# Altium schematic sheet CONNECTOR_B.SchDoc: =project_title
size Tabloid; CompanyName: Luxonis Holding; Organization: Luxonis Holding; Address1: 1925 Harmony Park Drive; Address2: Westminster, CO; Address3: 80234; Address4: United States; SheetNumber: 6; SheetTotal: 13
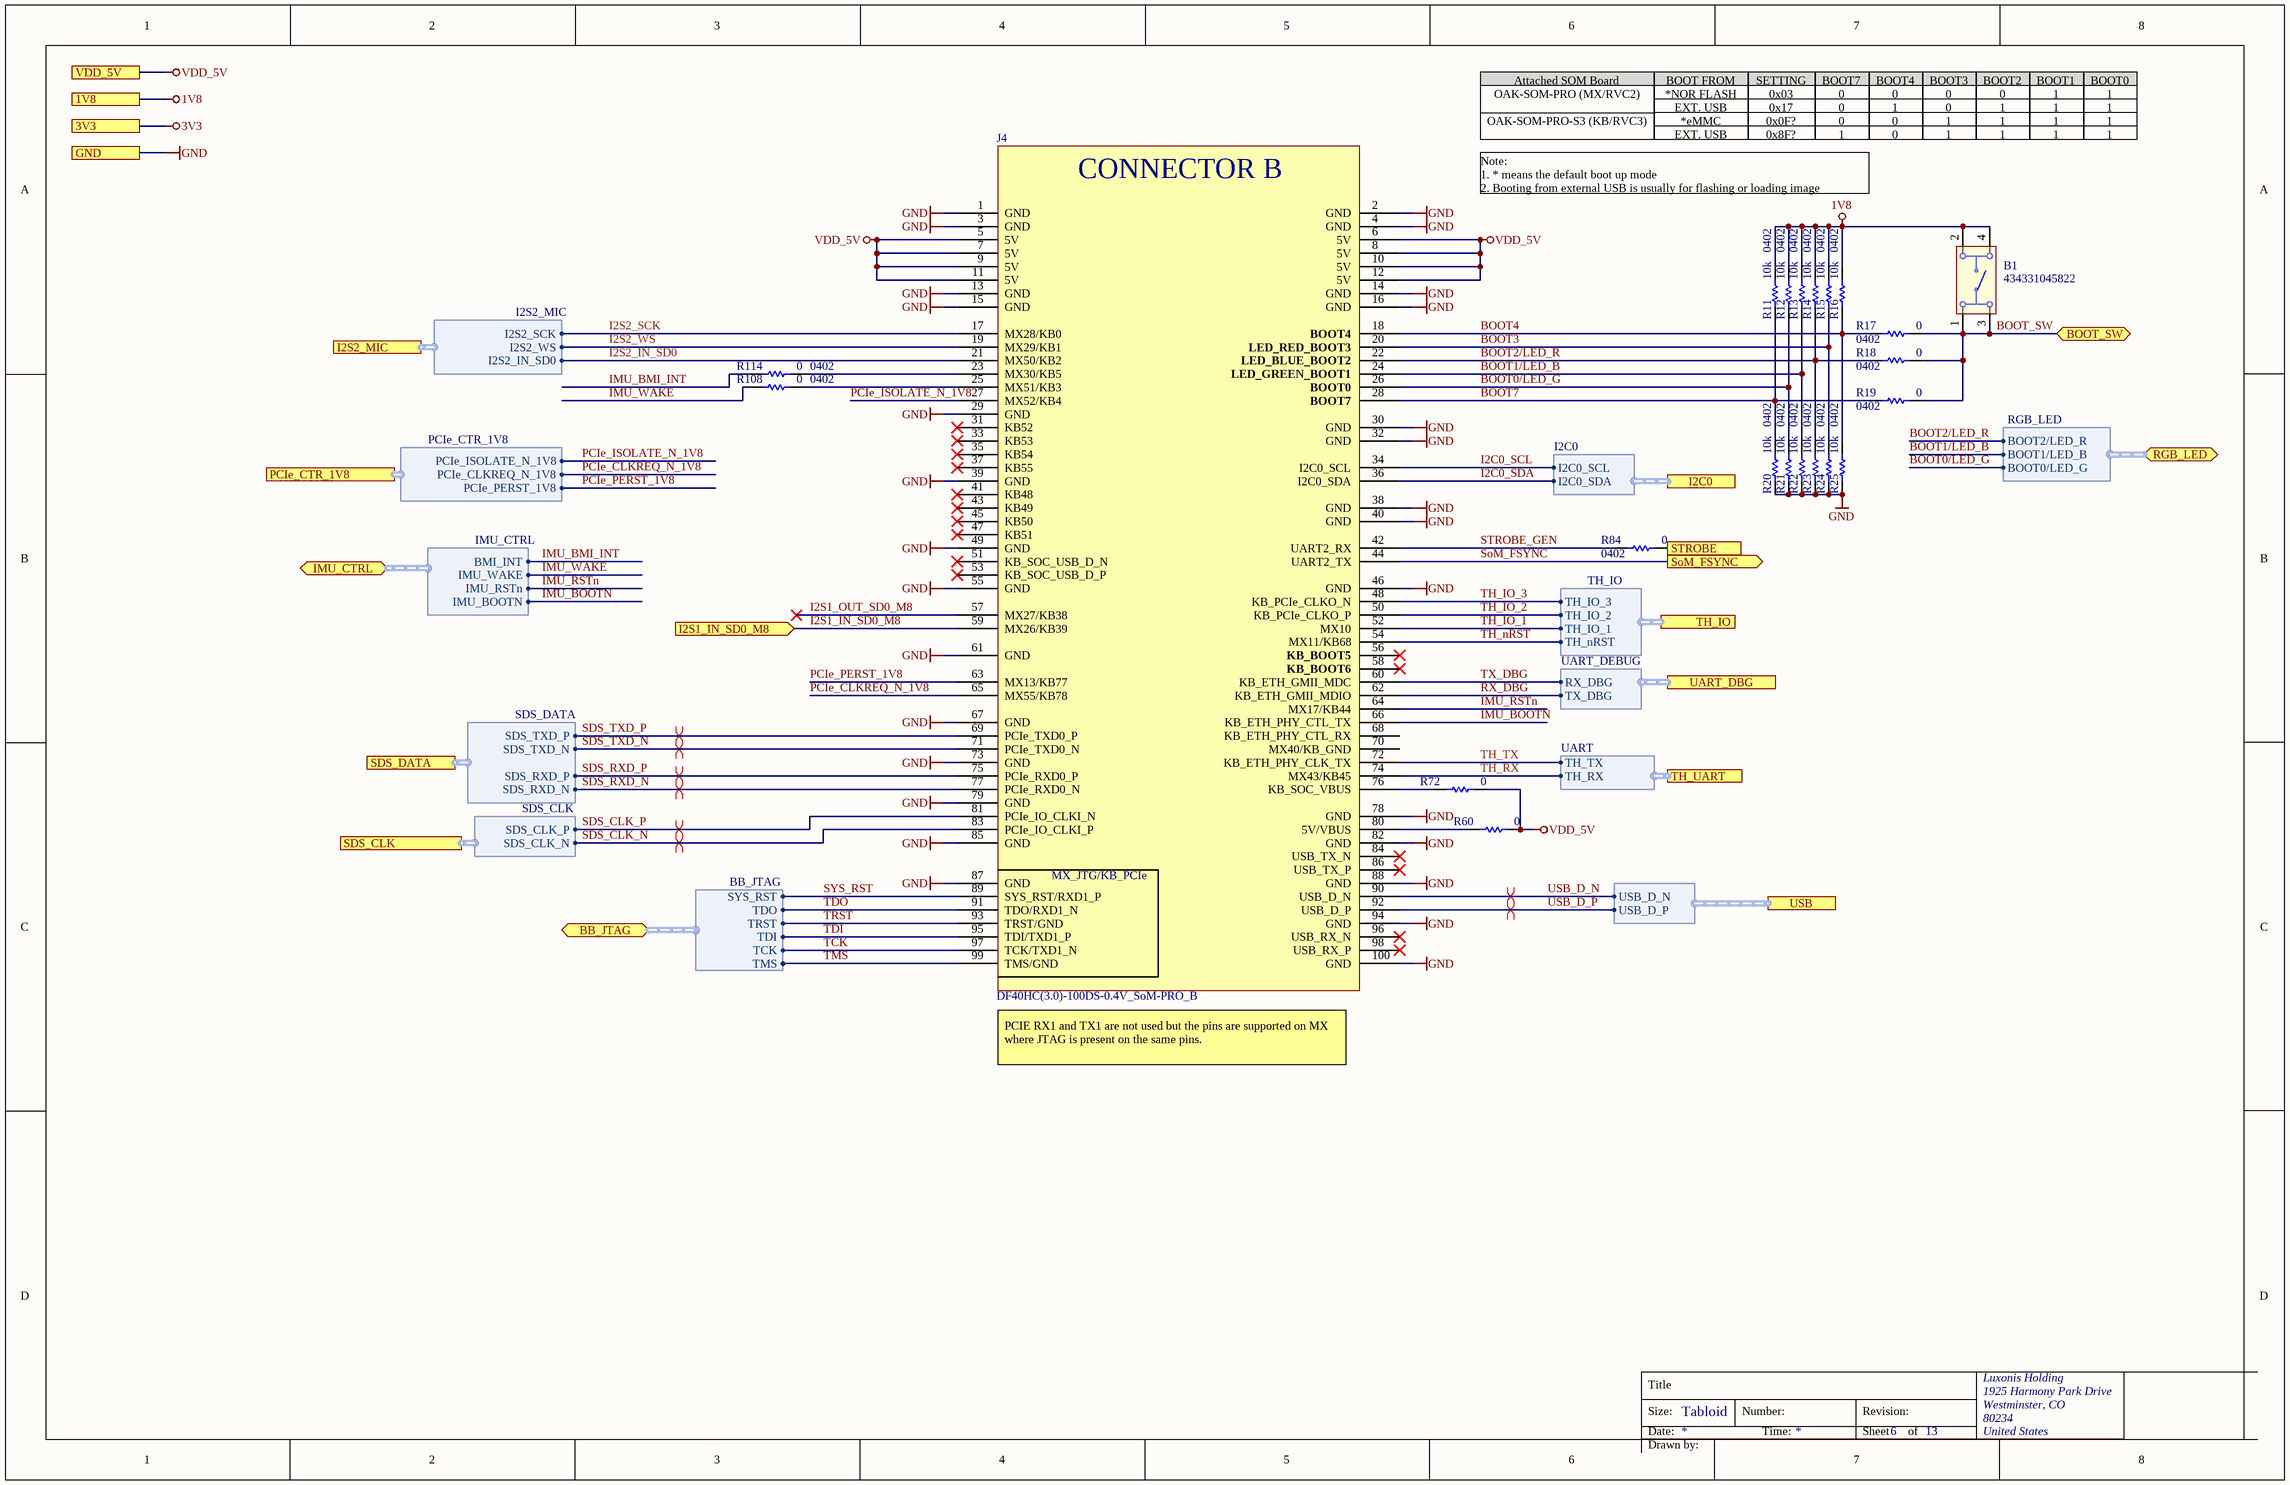
[diagram p0: CONNECTOR_B.SchDoc]

## Parts
B1  434331045822  [434331045822]
J4  DF40HC(3.0)-100DS-0.4V_SoM-PRO_B  [CON_B_BW2099_SoM_DF40HC-3.0-100DS-0.4V_minpad]
R11  value 10k  Case/Package: 0402  [RESC0402(1005)_N]  (hidden comment: RC0402FR-1310KL)
R12  value 10k  Case/Package: 0402  [RESC0402(1005)_N]  (hidden comment: RC0402FR-1310KL)
R13  value 10k  Case/Package: 0402  [RESC0402(1005)_N]  (hidden comment: RC0402FR-1310KL)
R14  value 10k  Case/Package: 0402  [RESC0402(1005)_N]  (hidden comment: RC0402FR-1310KL)
R15  value 10k  Case/Package: 0402  [RESC0402(1005)_N]  (hidden comment: RC0402FR-1310KL)
R16  value 10k  Case/Package: 0402  [RESC0402(1005)_N]  (hidden comment: RC0402FR-1310KL)
R17  value 0  Case/Package: 0402  [RESC0402(1005)_L]  (hidden comment: CRCW04020000Z0ED)
R18  value 0  Case/Package: 0402  [RESC0402(1005)_L]  (hidden comment: CRCW04020000Z0ED)
R19  value 0  Case/Package: 0402  [RESC0402(1005)_L]  (hidden comment: CRCW04020000Z0ED)
R20  value 10k  Case/Package: 0402  [RESC0402(1005)_N]  (hidden comment: RC0402FR-1310KL)
R21  value 10k  Case/Package: 0402  [RESC0402(1005)_N]  (hidden comment: RC0402FR-1310KL)
R22  value 10k  Case/Package: 0402  [RESC0402(1005)_N]  (hidden comment: RC0402FR-1310KL)
R23  value 10k  Case/Package: 0402  [RESC0402(1005)_N]  (hidden comment: RC0402FR-1310KL)
R24  value 10k  Case/Package: 0402  [RESC0402(1005)_N]  (hidden comment: RC0402FR-1310KL)
R25  value 10k  Case/Package: 0402  [RESC0402(1005)_N]  (hidden comment: RC0402FR-1310KL)
R60  value 0  [RESC0402(1005)_L]  (hidden comment: CRCW04020000Z0ED)
R72  value 0  [RESC0402(1005)_L]  (hidden comment: CRCW04020000Z0ED)
R84  value 0  Case/Package: 0402  [RESC0402(1005)_L]  (hidden comment: CRCW04020000Z0ED)
R108  value 0  Case/Package: 0402  [RESC0402(1005)_L]  (hidden comment: CRCW04020000Z0ED)
R114  value 0  Case/Package: 0402  [RESC0402(1005)_L]  (hidden comment: CRCW04020000Z0ED)

## Ports
1V8, 3V3, BB_JTAG (bidir, harness BB_JTAG), BOOT_SW (bidir), GND, I2C0 (harness I2C0), I2S1_IN_SD0_M8 (in), I2S2_MIC (harness I2S2_MIC), IMU_CTRL (bidir, harness IMU_CTRL), PCIe_CTR_1V8 (harness PCIe_CTR_1V8), RGB_LED (bidir, harness RGB_LED), SDS_CLK (harness SDS_CLK), SDS_DATA (harness SDS_DATA), SoM_FSYNC (out), STROBE (out), TH_IO (harness TH_IO), TH_UART (harness UART), UART_DBG (harness UART_DEBUG), USB (harness USB), VDD_5V

## Harnesses
I2C0: I2C0_SDA, I2C0_SCL
BB_JTAG: SYS_RST, TDO, TRST, TDI, TCK, TMS
RGB_LED: BOOT2/LED_R, BOOT1/LED_B, BOOT0/LED_G
USB: USB_D_P, USB_D_N
I2S2_MIC: I2S2_SCK, I2S2_WS, I2S2_IN_SD0
UART_DEBUG: RX_DBG, TX_DBG
SDS_DATA: SDS_TXD_P, SDS_TXD_N, SDS_RXD_P, SDS_RXD_N
SDS_CLK: SDS_CLK_P, SDS_CLK_N
PCIe_CTR_1V8: PCIe_CLKREQ_N_1V8, PCIe_ISOLATE_N_1V8, PCIe_PERST_1V8
TH_IO: TH_IO_3, TH_IO_2, TH_IO_1, TH_nRST
UART: TH_RX, TH_TX
IMU_CTRL: BMI_INT, IMU_WAKE, IMU_RSTn, IMU_BOOTN

## Nets
1V8: B1.2 B1.4 R11.2 R12.2 R13.2 R14.2 R15.2 R16.2 ; port 1V8
3V3: port 3V3
GND: J4.1(GND) J4.2(GND) J4.3(GND) J4.4(GND) J4.13(GND) J4.14(GND) J4.15(GND) J4.16(GND) J4.29(GND) J4.30(GND) J4.32(GND) J4.38(GND) J4.39(GND) J4.40(GND) J4.46(GND) J4.49(GND) J4.55(GND) J4.61(GND) J4.67(GND) J4.73(GND) J4.78(GND) J4.79(GND) J4.82(GND) J4.85(GND) J4.87(GND) J4.88(GND) J4.94(GND) J4.100(GND) R20.1 R21.1 R22.1 R23.1 R24.1 R25.1 ; port GND
VDD_5V: J4.5(5V) J4.6(5V) J4.7(5V) J4.8(5V) J4.9(5V) J4.10(5V) J4.11(5V) J4.12(5V) R60.2 R72.2 ; port VDD_5V
BOOT0/LED_G: J4.26(BOOT0) R12.1 R21.2 ; port RGB_LED.BOOT0/LED_G
BOOT1/LED_B: J4.24(LED_GREEN_BOOT1) R13.1 R22.2 ; port RGB_LED.BOOT1/LED_B
BOOT2/LED_R: J4.22(LED_BLUE_BOOT2) R14.1 R18.1 R23.2 ; port RGB_LED.BOOT2/LED_R
BOOT3: J4.20(LED_RED_BOOT3) R15.1 R24.2
BOOT4: J4.18(BOOT4) R16.1 R17.1 R25.2
BOOT7: J4.28(BOOT7) R11.1 R19.1 R20.2
BOOT_SW: B1.1 B1.3 R17.2 R18.2 R19.2 ; port BOOT_SW
I2C0_SCL: J4.34(I2C0_SCL) ; port I2C0.I2C0_SCL
I2C0_SDA: J4.36(I2C0_SDA) ; port I2C0.I2C0_SDA
I2S1_IN_SD0_M8: J4.59(MX26/KB39) ; port I2S1_IN_SD0_M8
I2S1_OUT_SD0_M8: J4.57(MX27/KB38)
I2S2_IN_SD0: J4.21(MX50/KB2) ; port I2S2_MIC.I2S2_IN_SD0
I2S2_SCK: J4.17(MX28/KB0) ; port I2S2_MIC.I2S2_SCK
I2S2_WS: J4.19(MX29/KB1) ; port I2S2_MIC.I2S2_WS
IMU_BMI_INT: R114.1 ; port IMU_CTRL.BMI_INT
IMU_BOOTN: J4.66(KB_ETH_PHY_CTL_TX) ; port IMU_CTRL.IMU_BOOTN
IMU_RSTn: J4.64(MX17/KB44) ; port IMU_CTRL.IMU_RSTn
IMU_WAKE: R108.1 ; port IMU_CTRL.IMU_WAKE
PCIe_CLKREQ_N_1V8: J4.65(MX55/KB78) ; port PCIe_CTR_1V8.PCIe_CLKREQ_N_1V8
PCIe_ISOLATE_N_1V8: J4.27(MX52/KB4) ; port PCIe_CTR_1V8.PCIe_ISOLATE_N_1V8
PCIe_PERST_1V8: J4.63(MX13/KB77) ; port PCIe_CTR_1V8.PCIe_PERST_1V8
RX_DBG: J4.62(KB_ETH_GMII_MDIO) ; port UART_DBG.TX_DBG
SDS_CLK_N: J4.83(PCIe_IO_CLKI_P) ; port SDS_CLK.SDS_CLK_N
SDS_CLK_P: J4.81(PCIe_IO_CLKI_N) ; port SDS_CLK.SDS_CLK_P
SDS_RXD_N: J4.77(PCIe_RXD0_N) ; port SDS_DATA.SDS_RXD_N
SDS_RXD_P: J4.75(PCIe_RXD0_P) ; port SDS_DATA.SDS_RXD_P
SDS_TXD_N: J4.71(PCIe_TXD0_N) ; port SDS_DATA.SDS_TXD_N
SDS_TXD_P: J4.69(PCIe_TXD0_P) ; port SDS_DATA.SDS_TXD_P
SoM_FSYNC: J4.44(UART2_TX) ; port SoM_FSYNC
STROBE: R84.2 ; port STROBE
STROBE_GEN: J4.42(UART2_RX) R84.1
SYS_RST: J4.89(SYS_RST/RXD1_P) ; port BB_JTAG.SYS_RST
TCK: J4.97(TCK/TXD1_N) ; port BB_JTAG.TCK
TDI: J4.95(TDI/TXD1_P) ; port BB_JTAG.TDI
TDO: J4.91(TDO/RXD1_N) ; port BB_JTAG.TDO
TH_IO_1: J4.52(MX10) ; port TH_IO.TH_IO_1
TH_IO_2: J4.50(KB_PCIe_CLKO_P) ; port TH_IO.TH_IO_2
TH_IO_3: J4.48(KB_PCIe_CLKO_N) ; port TH_IO.TH_IO_3
TH_nRST: J4.54(MX11/KB68) ; port TH_IO.TH_nRST
TH_RX: J4.74(MX43/KB45) ; port TH_UART.TH_RX
TH_TX: J4.72(KB_ETH_PHY_CLK_TX) ; port TH_UART.TH_TX
TMS: J4.99(TMS/GND) ; port BB_JTAG.TMS
TRST: J4.93(TRST/GND) ; port BB_JTAG.TRST
TX_DBG: J4.60(KB_ETH_GMII_MDC) ; port UART_DBG.RX_DBG
USB_D_N: J4.90(USB_D_N) ; port USB.USB_D_N
USB_D_P: J4.92(USB_D_P) ; port USB.USB_D_P
NetJ4_23: J4.23(MX30/KB5) R114.2
NetJ4_25: J4.25(MX51/KB3) R108.2
NetJ4_76: J4.76(KB_SOC_VBUS) R72.1
NetJ4_80: J4.80(5V/VBUS) R60.1

Not connected (* = marked no-connect by the designer): J4 31(KB52)* 33(KB53)* 35(KB54)* 37(KB55)* 41(KB48)* 43(KB49)* 45(KB50)* 47(KB51)* 51(KB_SOC_USB_D_N)* 53(KB_SOC_USB_D_P)* 56(KB_BOOT5)* 58(KB_BOOT6)* 68(KB_ETH_PHY_CTL_RX) 70(MX40/KB_GND) 84(USB_TX_N)* 86(USB_TX_P)* 96(USB_RX_N)* 98(USB_RX_P)*

## Layout directives
differential pair; net class USB2; differential pair class 90ohm: USB_D_N, USB_D_P
differential pair; net class PCIE; differential pair class 100ohm: SDS_CLK_N, SDS_CLK_P, SDS_RXD_N, SDS_RXD_P, SDS_TXD_N, SDS_TXD_P

## Notes on the sheet
- Attached SOM Board
- BOOT FROM
- *NOR FLASH
- SETTING
- 0x03
- BOOT7
- 0
- BOOT4
- BOOT3
- BOOT2
- BOOT1
- 1
- BOOT0
- OAK-SOM-PRO-S3 (KB/RVC3)
- OAK-SOM-PRO (MX/RVC2)
- EXT. USB
- *eMMC
- 0x17
- 0x0F?
- 0x8F?
- Note:
  1. * means the default boot up mode
  2. Booting from external USB is usually for flashing or loading image
- (near J4) PCIE RX1 and TX1 are not used but the pins are supported on MX where JTAG is present on the same pins.
- Title
- Size:
- Date:
- Tabloid
- Number:
- Time:
- Revision:
- Sheet
- of
- Drawn by:
- (in symbol CMP-002-00155-7) CONNECTOR B; MX_JTG/KB_PCIe

## Library data of the parts
B1 = CMP-011-00016-3: Keypad Switch, 1 Switches, SPST, Momentary-tactile, 0.05A, 12VDC, 2.65N, Solder Terminal, Surface Mount-right Angle; Manufacturer 1: Wurth Electronics; Voltage Rating: 12V; Max Current Rating: 50mA; Throw Configuration: SPST-NO; Manufacturer part number 1: 434331045822; Supplier Part Number 1: 732-7055-2-ND; Pins: 4; Supplier 1: Digi-Key; Current Rating: 50mA; Mounting Technology: SMD; Case/Package: 434331045822
J4 = CMP-002-00155-7: OAK-SoM-Pro_S2/S3 base board conn. B; Manufacturer 1: Hirose; Manufacturer Part Number 1: DF40HC(3.0)-100DS-0.4V(58); Gender: Female; Number of Positions: 100; Connector Type: Receptacle; System: Connector; Pitch: 0.016inch; Contact Plating: Gold; Stock 2: 2078; ComponentLink4URL: https://datasheet.ciiva.com/18562/ed-df40-20140305-18562462.pdf?src-supplier=Digi-Key; ComponentLink1Description: https://datasheet.ciiva.com/46636/ed-df40-20140305-46636517.pdf?src-supplier=Digi-Key; Source: LuxonisMaster.SchLib; Lead Free: Lead Free; Mounting Technology: SMT; Pricing 2: 1=2.50000, 10=2.40000, 25=2.10000, 50=2.10000, 100=2.00000, 250=1.76000, 500=1.71000, 1000=1.45000, 2000=1.36000, 5000=1.31000, 10000=1.31000 (USD); ComponentLink2Description: https://datasheet.ciiva.com/18562/ed-df40-20140305-18562189.pdf?src-supplier=Digi-Key; RoHS: Yes; Design Item ID: DF40HC(3.0)-100DS-0.4V_SoM-PRO_B; Pricing 1: 1=2.54000, 10=2.26000, 25=2.07000, 50=2.07000, 100=1.98000, 250=1.79000, 500=1.65000, 1000=1.41000, 3000=1.32000, 6000=1.23000, 10000=1.23000 (USD); ComponentLink3URL: https://datasheet.ciiva.com/13559/ed-df40-20140305-13559540.pdf?src-supplier=Mouser; Mount: Surface Mount; ComponentLink2URL: https://datasheet.ciiva.com/18562/ed-df40-20140305-18562189.pdf?src-supplier=Digi-Key; Packaging: Tape and Reel; Stock 1: 2172; ComponentLink1URL: https://datasheet.ciiva.com/46636/ed-df40-20140305-46636517.pdf?src-supplier=Digi-Key; Package Quantity: 1000; Pins: 100; Number of Rows: 2; ComponentLink3Description: https://datasheet.ciiva.com/13559/ed-df40-20140305-13559540.pdf?src-supplier=Mouser; ComponentLink4Description: https://datasheet.ciiva.com/18562/ed-df40-20140305-18562462.pdf?src-supplier=Digi-Key
R11-R16 R20-R25 = CMP-115-000004-8: RES SMD 10K OHM 1% 1/16W 0402; Manufacturer 1: Yageo; Power Rating: 62.5mW; Temperature Coefficient: 100ppm/°C; Voltage Rating: 50V; Min Operating Temperature: -55°C; Max Operating Temperature: 155°C; Design Item ID: RC0402FR-1310KL; Tolerance: 1%; Manufacturer Part Number 1: RC0402FR-1310KL
R17-R19 R60 R72 R84 R108 R114 = CMP-013-000022-11: RES SMD 0 OHM 5% 1/16W 0402; Manufacturer 1: Vishay; Voltage Rating: 50V; Power Rating: 63mW; Max Operating Temperature: 155°C; Manufacturer Part Number 1: CRCW04020000Z0ED; Tolerance: 5%; Min Operating Temperature: -55°C; Design Item ID: CRCW04020000Z0ED
  R60 R72: Case/Package: 0402